# Altium project OWMR.PrjPcb
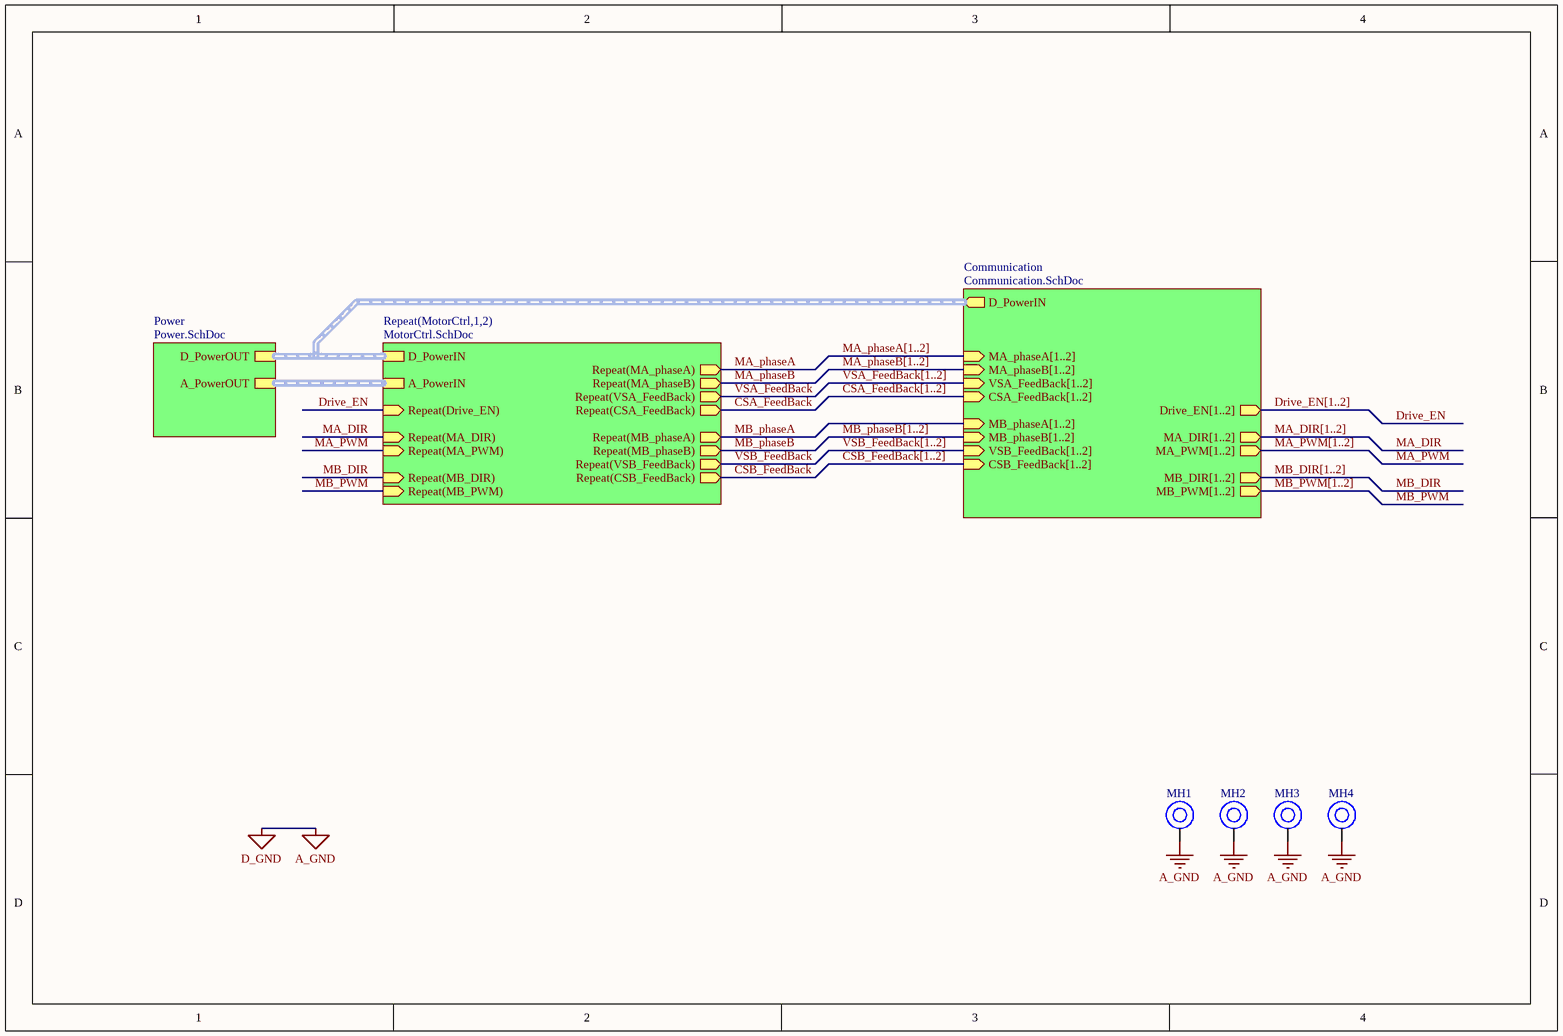
[diagram p0: Top.SchDoc]
5 sheets, 73 parts. Net scope: hierarchical (ports join the sheet entries above them; power ports are global).
Board file: Top.PcbDoc
Sheets:
  Top.SchDoc
    Power = Power.SchDoc
    MotorCtrl1 = MotorCtrl.SchDoc
    MotorCtrl2 = MotorCtrl.SchDoc
    Communication = Communication.SchDoc
  Simulation.SchDoc

## Sheet Top.SchDoc
size A4; SheetNumber: 1; SheetTotal: 4

### Parts
MH1  M3 Hole  [M3 Hole]  (value not drawn)
MH2  M3 Hole  [M3 Hole]  (value not drawn)
MH3  M3 Hole  [M3 Hole]  (value not drawn)
MH4  M3 Hole  [M3 Hole]  (value not drawn)

### Sub-sheets
Communication = Communication.SchDoc: MA_phaseA[1..2] (in), MA_phaseB[1..2] (in), VSA_FeedBack[1..2] (in), CSA_FeedBack[1..2] (in), MB_phaseA[1..2] (in), MB_phaseB[1..2] (in), VSB_FeedBack[1..2] (in), CSB_FeedBack[1..2] (in), Drive_EN[1..2] (out), MA_DIR[1..2] (out), MB_DIR[1..2] (out), MA_PWM[1..2] (out), MB_PWM[1..2] (out), D_PowerIN (out)
Power = Power.SchDoc: D_PowerOUT, A_PowerOUT
Repeat(MotorCtrl,1,2) = MotorCtrl.SchDoc: D_PowerIN, A_PowerIN, Repeat(MA_DIR) (in), Repeat(MA_PWM) (in), Repeat(MB_DIR) (in), Repeat(MB_PWM) (in), Repeat(Drive_EN) (in), Repeat(MA_phaseA) (out), Repeat(MA_phaseB) (out), Repeat(MB_phaseA) (out), Repeat(MB_phaseB) (out), Repeat(VSA_FeedBack) (out), Repeat(VSB_FeedBack) (out), Repeat(CSA_FeedBack) (out), Repeat(CSB_FeedBack) (out)

### Nets
A_GND: MH1.1 MH2.1 MH3.1 MH4.1  [also labelled D_GND]
CSA_FeedBack: sheet Repeat(MotorCtrl,1,2)/Repeat(CSA_FeedBack)
CSB_FeedBack: sheet Repeat(MotorCtrl,1,2)/Repeat(CSB_FeedBack)
Drive_EN: sheet Repeat(MotorCtrl,1,2)/Repeat(Drive_EN)
MA_DIR: sheet Repeat(MotorCtrl,1,2)/Repeat(MA_DIR)
MA_phaseA: sheet Repeat(MotorCtrl,1,2)/Repeat(MA_phaseA)
MA_phaseB: sheet Repeat(MotorCtrl,1,2)/Repeat(MA_phaseB)
MA_PWM: sheet Repeat(MotorCtrl,1,2)/Repeat(MA_PWM)
MB_DIR: sheet Repeat(MotorCtrl,1,2)/Repeat(MB_DIR)
MB_phaseA: sheet Repeat(MotorCtrl,1,2)/Repeat(MB_phaseA)
MB_phaseB: sheet Repeat(MotorCtrl,1,2)/Repeat(MB_phaseB)
MB_PWM: sheet Repeat(MotorCtrl,1,2)/Repeat(MB_PWM)
VSA_FeedBack: sheet Repeat(MotorCtrl,1,2)/Repeat(VSA_FeedBack)
VSB_FeedBack: sheet Repeat(MotorCtrl,1,2)/Repeat(VSB_FeedBack)

### Buses and harness runs
bus CSA_FeedBack[1..2] = sheet Communication/CSA_FeedBack[1..2]
bus CSB_FeedBack[1..2] = sheet Communication/CSB_FeedBack[1..2]
bus Drive_EN[1..2] = sheet Communication/Drive_EN[1..2]
bus MA_DIR[1..2] = sheet Communication/MA_DIR[1..2]
bus MA_phaseA[1..2] = sheet Communication/MA_phaseA[1..2]
bus MA_phaseB[1..2] = sheet Communication/MA_phaseB[1..2]
bus MA_PWM[1..2] = sheet Communication/MA_PWM[1..2]
bus MB_DIR[1..2] = sheet Communication/MB_DIR[1..2]
bus MB_phaseB[1..2] = sheet Communication/MB_phaseB[1..2]
bus MB_PWM[1..2] = sheet Communication/MB_PWM[1..2]
bus VSA_FeedBack[1..2] = sheet Communication/VSA_FeedBack[1..2]
bus VSB_FeedBack[1..2] = sheet Communication/VSB_FeedBack[1..2]
harness sheet Communication/D_PowerIN = sheet Power/D_PowerOUT = sheet Repeat(MotorCtrl,1,2)/D_PowerIN
harness sheet Power/A_PowerOUT = sheet Repeat(MotorCtrl,1,2)/A_PowerIN

### Library data of the parts
MH1-MH4 = M3_Hole

## Sheet Power.SchDoc
size A4; SheetNumber: 2; SheetTotal: 5; SPICEModelCacheCCCFIGUR: <root> / <DocumentId>CCCFIGUR</DocumentId> / <CacheFrame Number="0"> / <Model Name="led0" Kind="MDL"> / <Text>*Typ INFRARED GaAs LED: Vf=1.2V Vr=5V If=40mA trr=3uS / *LED Pinout: 1=A, 2=K / .MODEL LED0 D (IS=93.5P RS=84M N=2.63 BV=5 IBV=10U / + CJO=2.97P VJ=.75 M=.333 TT=4.32U)</Text> / </Model> / </CacheFrame> / </root>
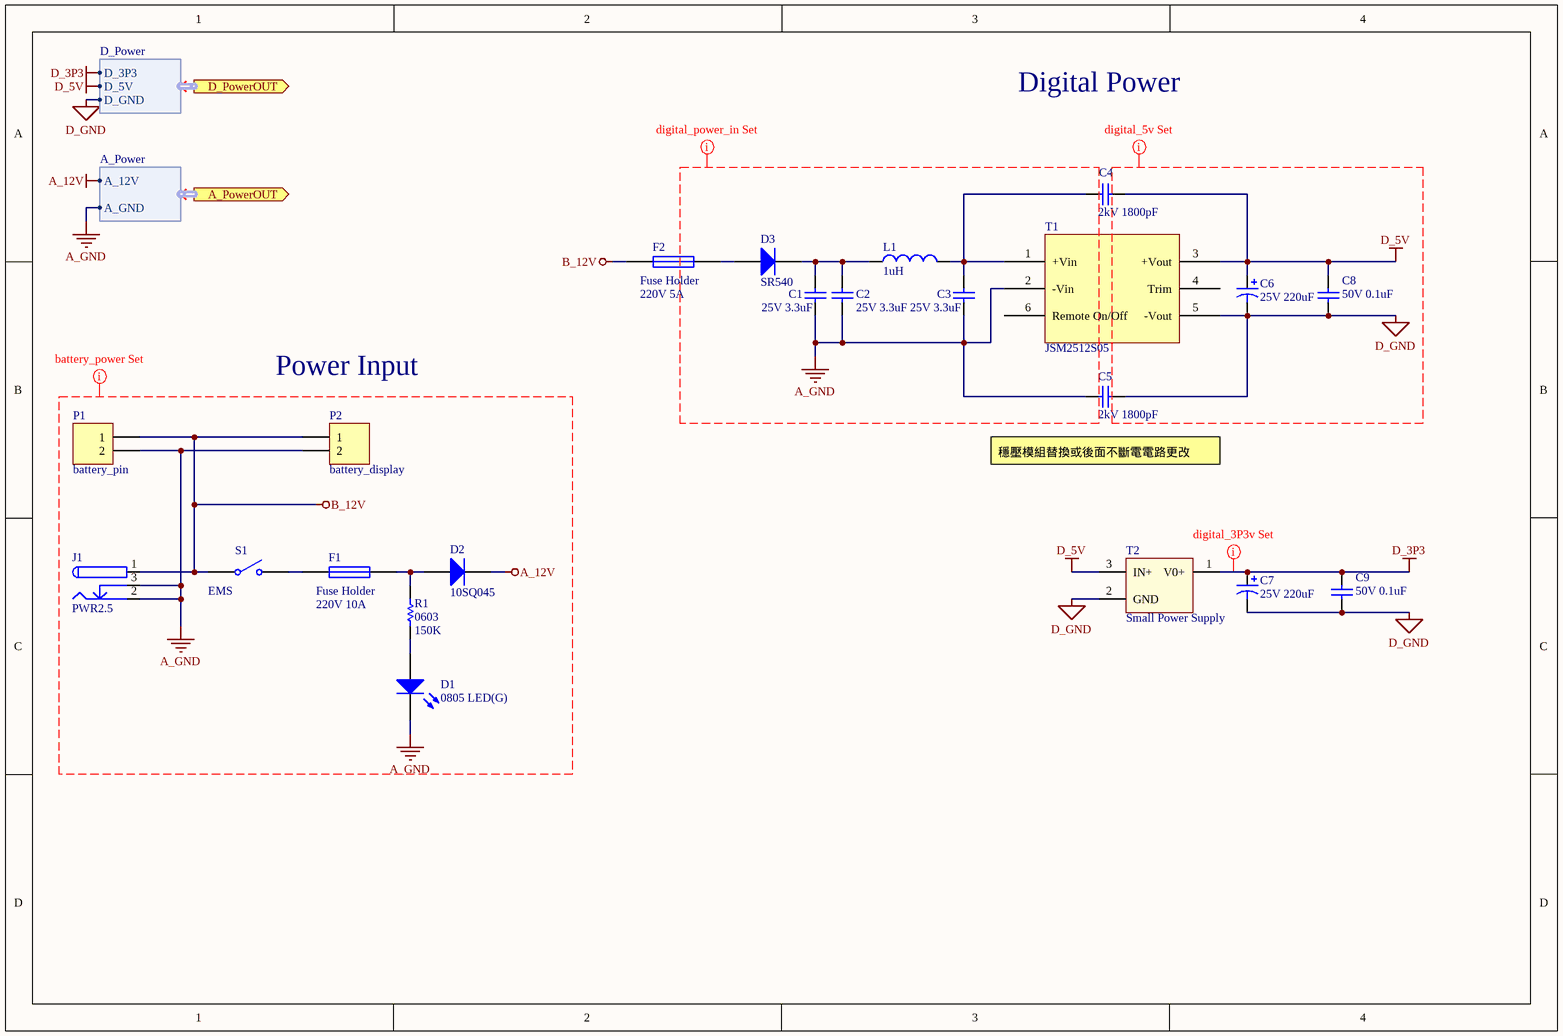
[diagram p1: Power.SchDoc]

### Parts
C1  25V 3.3uF  [1210 SMD]
C2  25V 3.3uF  [1210 SMD]
C3  25V 3.3uF  [1210 SMD]
C4  2kV 1800pF  [1206 SMD]
C5  2kV 1800pF  [1206 SMD]
C6  25V 220uF  [RB4-8]
C7  25V 220uF  [RB4-8]
C8  50V 0.1uF  [C1206]
C9  50V 0.1uF  [C1206]
D1  0805 LED(G)  [0805 SMD DIode]
D2  10SQ045  [10SQ045]
D3  SR540  [SR540]
F1  Fuse Holder  value 220V 10A  [SMD Fuses Holder]
F2  Fuse Holder  value 220V 5A  [SMD Fuses Holder]
J1  PWR2.5  [PWD2.5]
L1  1uH  [DFE2HCAH1R0MJ0L]
P1  battery_pin  [KF2EDGR-5.08 2P]
P2  battery_display  [B2B-XH-A]
R1  0603  value 150K  [0603 SMD Res]
S1  EMS  [4.8插片]
T1  JSM2512S05  [JSM2524S05]
T2  Small Power Supply  [Samll Power Supply]

### Ports
A_PowerOUT (out, harness A_Power), D_PowerOUT (out, harness D_Power)

### Harnesses
D_Power: D_3P3, D_5V, D_GND
A_Power: A_12V, A_GND

### Nets
A_12V: D2.2(K) ; port A_PowerOUT.A_12V
A_GND: C1.2 C2.2 C3.2 C5.1 C5.2 C6.2 C7.2 C8.1 C9.1 D1.2(K) J1.2 J1.3 P1.2 P2.2 T1.2(-Vin) T1.5(-Vout) T2.2(GND) ; port D_PowerOUT.D_GND, port A_PowerOUT.A_GND  [also labelled D_GND]
B_12V: F2.1 J1.1 P1.1 P2.1 S1.1(COMMON)
D_3P3: C7.1 C9.2 T2.1(V0+) ; port D_PowerOUT.D_3P3  [project net 3P3]
D_5V: C4.2 C6.1 C8.2 T1.3(+Vout) T2.3(IN+) ; port D_PowerOUT.D_5V  [project net 5V]
NetC1_1: C1.1 C2.1 D3.2(K) L1.1
NetC3_1: C3.1 C4.1 L1.2 T1.1(+Vin)
NetD1_1: D1.1(A) R1.1
NetD2_1: D2.1(A) F1.2 R1.2
NetD3_1: D3.1(A) F2.2
NetF1_1: F1.1 S1.2(NO)

Not connected (* = marked no-connect by the designer): T1 4(Trim) 6(Remote_On/Off)

### Layout directives
net class battery_power; rule Clearance Constraint [Generic clearance = 0.65mm, and 9 value(s) for objects]; rule Width Constraint [Pref Width = 1.67mm    Min Width = 0.254mm    Max Width = 2mm]; rule Routing Via Style [Pref Size = 1.67mm    Pref Hole Size = 0.9mm]: A_12V, A_GND, B_12V
net class digital_power_in; rule Clearance Constraint [Generic clearance = 0.65mm, and 9 value(s) for objects]; rule Width Constraint [Pref Width = 0.29mm    Min Width = 0.254mm    Max Width = 0.31mm]; rule Routing Via Style [Pref Size = 20mil    Pref Hole Size = 10mil]: A_GND
net class digital_5v; rule Clearance Constraint [Generic clearance = 0.61mm, and 9 value(s) for objects]; rule Width Constraint [Pref Width = 0.8mm    Min Width = 0.254mm    Max Width = 1mm]; rule Routing Via Style [Pref Size = 50mil    Pref Hole Size = 28mil]: D_5V, D_GND
net class digital_3P3v; rule Clearance Constraint [Generic clearance = 0.6mm, and 9 value(s) for objects]; rule Width Constraint [Pref Width = 0.254mm    Min Width = 0.254mm    Max Width = 0.381mm]; rule Routing Via Style [Pref Size = 20mil    Pref Hole Size = 10mil]: 3P3

### Notes on the sheet
- Digital Power
- Power Input
- (near C5) 穩壓模組替換或後面不斷電電路更改

### Library data of the parts
C1-C3 = Cap: 50V 3.3uF 1210 MLCC; Published: 8-Jun-2000; LatestRevisionDate: 17-Jul-2002; LatestRevisionNote: Re-released for DXP Platform.; PackageReference: RAD-0.3; Publisher: Altium Limited; PackageDescription: Radial Cap, Thru-Hole; 2 Leads; 0.3 in Pin Spacing; Value: 3.3uF
C4 C5 = Cap: Capacitor; Published: 8-Jun-2000; LatestRevisionDate: 17-Jul-2002; LatestRevisionNote: Re-released for DXP Platform.; PackageReference: RAD-0.3; Publisher: Altium Limited; PackageDescription: Radial Cap, Thru-Hole; 2 Leads; 0.3 in Pin Spacing; Value: 1800pF
C6 C7 = Cap Pol1: DIP cap; Value: 1000uF; Published: 8-Jun-2000; LatestRevisionDate: 17-Jul-2002; LatestRevisionNote: Re-released for DXP Platform.; PackageReference: RB7.6-15; Publisher: Altium Limited; PackageDescription: Polarized Capacitor (Radial); 2 Leads; ComponentLink1Description: buy_link; ComponentLink1URL: https://shopee.tw/(%E5%85%83%E8%80%80)-%E7%9B%B4%E6%8F%92-%E9%9B%BB%E8%A7%A3%E9%9B%BB%E5%AE%B9-47uF~1000uF-16V~50V-%E9%AB%94%E7%A9%8D-8*14.5mm~10*19.5mm(5%E9%A1%86%E4%B8%80%E6%A8%99)-i.140576581.2524079905?sp_atk=ccd45567-e386-4bfb-a6e8-2480335a57a5
C8 C9 = Cap Semi: 0805F105Z250CT; Value: 1uF; Published: 8-Jun-2000; LatestRevisionDate: 29-May-2009; LatestRevisionNote: IPC-7351 Footprint Added.; PackageReference: C1206; Publisher: Altium Limited; PackageDescription: Chip Capacitor
D1 = LED0: Typical INFRARED GaAs LED; Published: 8-Jun-2000; LatestRevisionDate: 08-Jul-2005; LatestRevisionNote: Mech Layer 1 removed.; PackageReference: LED-0; Publisher: Altium Limited; PackageDescription: LED; 2 Leads
D2 D3 = Diode: Default Diode; Published: 8-Jun-2000; LatestRevisionDate: 17-Jul-2002; LatestRevisionNote: Re-released for DXP Platform.; PackageVersion: Sep-1996; PackageReference: SMC; Publisher: Altium Limited; PackageDescription: DO-214-AB/SMC; 2 C-Bend Leads; Body 7.9 x 5.9 mm, inc. leads (LxW); Code_JEDEC: DO-214-AB
F1 = Fuse 1: 0451010.MRL; Published: 8-Jun-2000; LatestRevisionDate: 17-Jul-2002; LatestRevisionNote: Re-released for DXP Platform.; PackageReference: PIN-W2/E2.8; Publisher: Altium Limited; PackageDescription: Thru-Hole; 2 Leads
F2 = Fuse 1: 0451005.MRL; Published: 8-Jun-2000; LatestRevisionDate: 17-Jul-2002; LatestRevisionNote: Re-released for DXP Platform.; PackageReference: PIN-W2/E2.8; Publisher: Altium Limited; PackageDescription: Thru-Hole; 2 Leads
J1 = PWR2.5: Low Voltage Power Supply Connector; Published: 17-Dec-2003; DatasheetDocument: 09-May-2002; Publisher: Altium Limited; ComponentLink1Description: Manufacturer Link; ComponentLink1URL: http://domino.kycon.com/internet/Products.html
L1 = Inductor: 1uH 3A 1008 SMD lnductor; Code_IEC: 1005; Value: 2.2uH; Published: 8-Jun-2000; LatestRevisionDate: 29-May-2009; LatestRevisionNote: IPC-7351 Footprint Added.; PackageReference: 0402-A; Publisher: Altium Limited; PackageDescription: Chip Inductor; Code_JEITA: 0402
P1 = Header 2: KF2EDGR-5.08 2P; LatestRevisionDate: 17-Jul-2002; LatestRevisionNote: Re-released for DXP Platform.; Publisher: Altium Limited
P2 = Header 2: B2B-XH-A; LatestRevisionDate: 17-Jul-2002; LatestRevisionNote: Re-released for DXP Platform.; Publisher: Altium Limited
R1 = Res1: Resistor; Published: 8-Jun-2000; LatestRevisionDate: 17-Jul-2002; LatestRevisionNote: Re-released for DXP Platform.; PackageReference: AXIAL-0.3; Publisher: Altium Limited; PackageDescription: Axial Device, Thru-Hole; 2 Leads; 0.3 in Pin Spacing
S1 = SW-SPST: Published: 24-Mar-1999; LatestRevisionDate: 17-Jul-2002; LatestRevisionNote: Re-released for DXP Platform.; PackageReference: SPST-2; Publisher: Altium Limited; PackageDescription: Switch; 2 Leads
T1 = JSM2524S05: JSM2524S05 Isolation DC-DC converter
T2 = PowerSupply 3P: BuyLink: https://www.ruten.com.tw/item/show?21817939184609

## Sheet MotorCtrl.SchDoc
size A4; Organization: Altium Limited; Address1: L3, 12a Rodborough Rd; Address2: Frenchs Forest; Address3: NSW; Address4: Australia 2086; SheetNumber: 3; SheetTotal: 5; SPICEModelCacheSOUJEWZH: <root> / <DocumentId>SOUJEWZH</DocumentId> / <CacheFrame Number="0"> / <Model Name="cap" Kind="MDL"> / <Text>*Default semiconductor capacitor / .MODEL CAP C()</Text> / </Model> / </CacheFrame> / </root>
Used 2 times, as channels MotorCtrl1, MotorCtrl2. Parts and nets are listed once, with the designators drawn on the sheet.
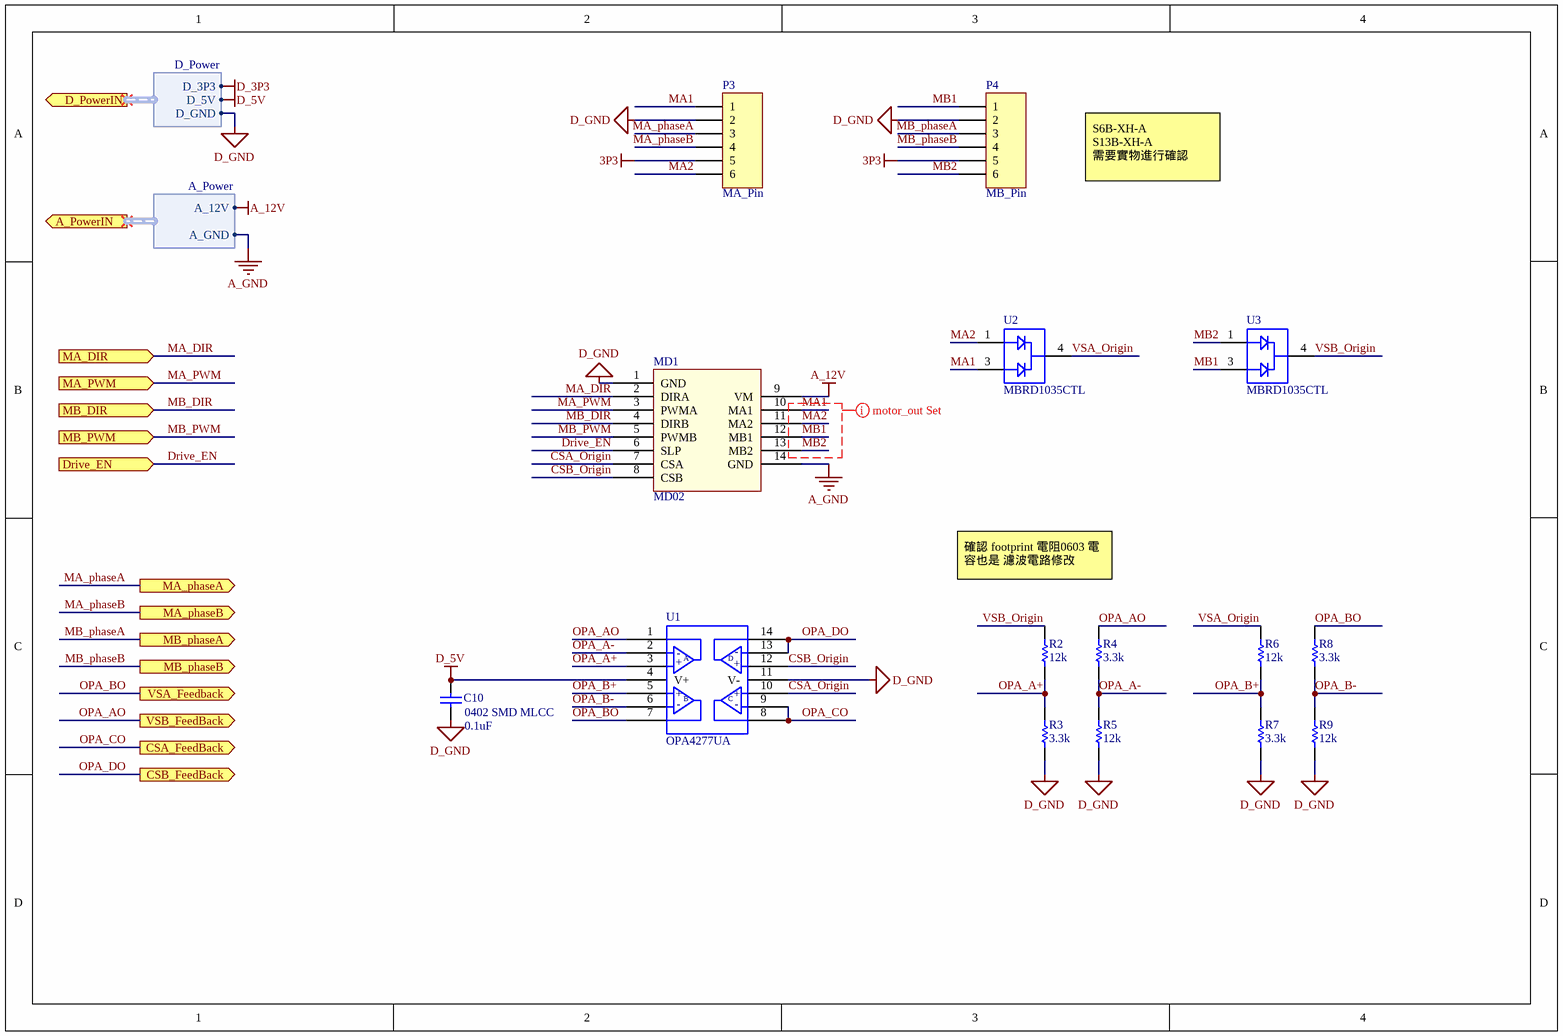
[diagram p2: MotorCtrl.SchDoc]

### Parts
C10  0402 SMD MLCC  value 0.1uF  [0402]
MD1  MD02  [MOTOR_DRIVER]
P3  MA_Pin  [S6B-XH-A]
P4  MB_Pin  [S6B-XH-A]
R2  12k  [0402 SMD Res]
R3  3.3k  [0402 SMD Res]
R4  3.3k  [0402 SMD Res]
R5  12k  [0402 SMD Res]
R6  12k  [0402 SMD Res]
R7  3.3k  [0402 SMD Res]
R8  3.3k  [0402 SMD Res]
R9  12k  [0402 SMD Res]
U1  OPA4277UA  [OPA4277UA]
U2  MBRD1035CTL  [MBRD1035CTL]
U3  MBRD1035CTL  [MBRD1035CTL]

### Ports
A_PowerIN (out, harness A_Power), CSA_FeedBack (out), CSB_FeedBack (out), D_PowerIN (out, harness D_Power), Drive_EN (in), MA_DIR (in), MA_phaseA (out), MA_phaseB (out), MA_PWM (in), MB_DIR (in), MB_phaseA (out), MB_phaseB (out), MB_PWM (in), VSA_Feedback (out), VSB_FeedBack (out)

### Harnesses
D_Power: D_3P3, D_5V, D_GND
A_Power: A_12V, A_GND

### Nets
3P3: P3.5 P4.5
A_12V: MD1.9(VM) ; port A_PowerIN.A_12V
A_GND: MD1.14(GND) ; port A_PowerIN.A_GND
D_3P3: port D_PowerIN.D_3P3
D_5V: C10.1 U1.4(V+) ; port D_PowerIN.D_5V
D_GND: C10.2 MD1.1(GND) P3.2 P4.2 R3.2 R5.1 R7.2 R9.1 U1.11(V-) ; port D_PowerIN.D_GND
CSA_Origin: MD1.7(CSA) U1.10(+in_C)
CSB_Origin: MD1.8(CSB) U1.12(+In_D)
Drive_EN: MD1.6(SLP) ; port Drive_EN
MA1: MD1.10(MA1) P3.1 U2.3
MA2: MD1.11(MA2) P3.6 U2.1
MA_DIR: MD1.2(DIRA) ; port MA_DIR
MA_phaseA: P3.3 ; port MA_phaseA
MA_phaseB: P3.4 ; port MA_phaseB
MA_PWM: MD1.3(PWMA) ; port MA_PWM
MB1: MD1.12(MB1) P4.1 U3.3
MB2: MD1.13(MB2) P4.6 U3.1
MB_DIR: MD1.4(DIRB) ; port MB_DIR
MB_phaseA: P4.3 ; port MB_phaseA
MB_phaseB: P4.4 ; port MB_phaseB
MB_PWM: MD1.5(PWMB) ; port MB_PWM
OPA_A+: R2.2 R3.1 U1.3(+In_A)
OPA_A-: R4.1 R5.2 U1.2(-In_A)
OPA_AO: R4.2 U1.1(Out_A) ; port VSB_FeedBack
OPA_B+: R6.2 R7.1 U1.5(+In_B)
OPA_B-: R8.1 R9.2 U1.6(-In_B)
OPA_BO: R8.2 U1.7(Out_B) ; port VSA_Feedback
OPA_CO: U1.8(Out_C) U1.9(-In_C) ; port CSA_FeedBack
OPA_DO: U1.13(-In_D) U1.14(Out_D) ; port CSB_FeedBack
VSA_Origin: R6.1 U2.4
VSB_Origin: R2.1 U3.4

### Channels
MotorCtrl1: designators end in _1; ports CSA_FeedBack=CSA_FeedBack1 CSB_FeedBack=CSB_FeedBack1 Drive_EN=Drive_EN MA_DIR=MA_DIR MA_phaseA=MA_phaseA MA_phaseB=MA_phaseB MA_PWM=MA_PWM MB_DIR=MB_DIR MB_phaseA=MB_phaseA_MotorCtrl1 MB_phaseB=MB_phaseB MB_PWM=MB_PWM VSA_Feedback=MA_V1 VSB_FeedBack=MB_V1
MotorCtrl2: designators end in _2; ports CSA_FeedBack=CSA_FeedBack2 CSB_FeedBack=CSB_FeedBack2 Drive_EN=Drive_EN MA_DIR=MA_DIR MA_phaseA=MA_phaseA MA_phaseB=MA_phaseB MA_PWM=MA_PWM MB_DIR=MB_DIR MB_phaseA=MB_phaseA_MotorCtrl2 MB_phaseB=MB_phaseB MB_PWM=MB_PWM VSA_Feedback=MA_V2 VSB_FeedBack=MB_V2

### Layout directives
net class motor_out; rule Clearance Constraint [Generic clearance = 0.65mm, and 9 value(s) for objects]; rule Width Constraint [Pref Width = 0.381mm    Min Width = 0.254mm    Max Width = 0.381mm]; rule Routing Via Style [Pref Size = 20mil    Pref Hole Size = 10mil]: MA1, MA2, MB1, MB2

### Notes on the sheet
- S6B-XH-A
  S13B-XH-A
  需要實物進行確認
- 確認 footprint 電阻0603 電容也是 濾波電路修改
- Title
- Size:
- Date:
- A4
- Number:
- Time:
- Revision:
- Sheet
- of
- File:
- (in symbol Small Signal Amplifier) －; A; D; +; B; C

### Library data of the parts
C10 = Cap Semi: Capacitor (Semiconductor SIM Model); Published: 8-Jun-2000; LatestRevisionDate: 29-May-2009; LatestRevisionNote: IPC-7351 Footprint Added.; PackageReference: C1206; Publisher: Altium Limited; PackageDescription: Chip Capacitor
MD1 = Motor Driver: 17A 2 Cheel Motor Driver; buy_link: https://www.ruten.com.tw/item/show?21811773783671
P3 P4 = Header 6: S6B-XH-A; LatestRevisionDate: 17-Jul-2002; LatestRevisionNote: Re-released for DXP Platform.; Publisher: Altium Limited
R2-R9 = Res1: Resistor; Published: 8-Jun-2000; LatestRevisionDate: 17-Jul-2002; LatestRevisionNote: Re-released for DXP Platform.; PackageReference: AXIAL-0.3; Publisher: Altium Limited; PackageDescription: Axial Device, Thru-Hole; 2 Leads; 0.3 in Pin Spacing
U1 = Small Signal Amplifier: buy_link: https://www.ruten.com.tw/item/show?22015419000992; datasheet: https://datasheet.ciiva.com/27050/905643-27050822.pdf?src-supplier=Jameco
U2 U3 = Diode IC: 35V 10A 2 Cheel Diode; buy_link: https://www.ruten.com.tw/item/show?21744290003226; datasheet: https://datasheet.ciiva.com/905/mbrd1035ctl-d-905952.pdf?src-supplier=Digi-Key

## Sheet Communication.SchDoc
size A4; SheetNumber: 4; SheetTotal: 5; SPICEModelCacheIYTLMHPF: <root> / <DocumentId>IYTLMHPF</DocumentId> / <CacheFrame Number="0"> / <Model Name="led0" Kind="MDL"> / <Text>*Typ INFRARED GaAs LED: Vf=1.2V Vr=5V If=40mA trr=3uS / *LED Pinout: 1=A, 2=K / .MODEL LED0 D (IS=93.5P RS=84M N=2.63 BV=5 IBV=10U / + CJO=2.97P VJ=.75 M=.333 TT=4.32U)</Text> / </Model> / </CacheFrame> / </root>
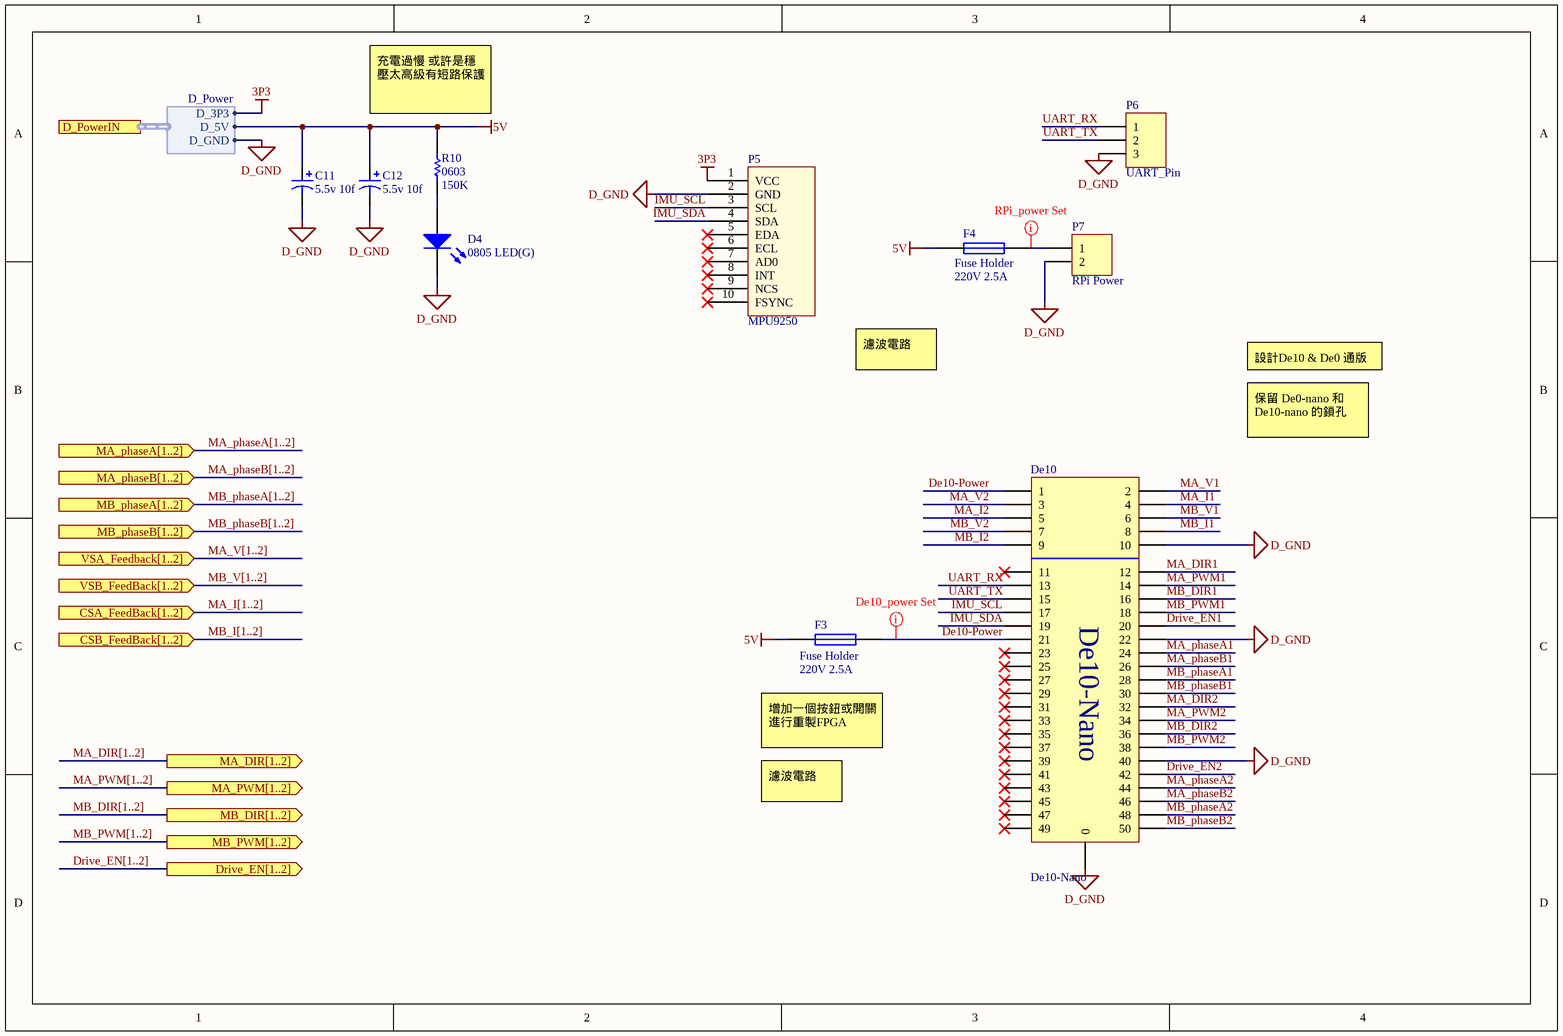
[diagram p3: Communication.SchDoc]

### Parts
C11  5.5v 10f  [SUPPYCAP-DIP_L33.0_W16.5]
C12  5.5v 10f  [SUPPYCAP-DIP_L33.0_W16.5]
D4  0805 LED(G)  [0805 SMD DIode]
De10  De10-Nano  [De10-Nano]
F3  Fuse Holder  value 220V 2.5A  [SMD Fuses Holder]
F4  Fuse Holder  value 220V 2.5A  [SMD Fuses Holder]
P5  MPU9250  [MPU9250]
P6  UART_Pin  [B3B-XH-A]
P7  RPi Power  [B2B-XH-A]
R10  0603  value 150K  [0603 SMD Res]

### Ports
CSA_FeedBack[1..2] (in), CSB_FeedBack[1..2] (in), D_PowerIN (harness D_Power), Drive_EN[1..2] (out), MA_DIR[1..2] (out), MA_phaseA[1..2] (in), MA_phaseB[1..2] (in), MA_PWM[1..2] (out), MB_DIR[1..2] (out), MB_phaseA[1..2] (in), MB_phaseB[1..2] (in), MB_PWM[1..2] (out), VSA_Feedback[1..2] (in), VSB_FeedBack[1..2] (in)

### Harnesses
D_Power: D_3P3, D_5V, D_GND

### Nets
3P3: P5.1(VCC) ; port D_PowerIN.D_3P3
5V: C11.1 C12.1 F3.1 F4.1 R10.2 ; port D_PowerIN.D_5V
D_GND: C11.2 C12.2 D4.2(K) De10.0 De10.10 De10.22 De10.40 P5.2(GND) P6.3 P7.2 ; port D_PowerIN.D_GND  [project net A_GND]
De10-Power: De10.1 De10.21 F3.2
Drive_EN1: De10.20  [project net Drive_EN]
Drive_EN2: De10.42  [project net Drive_EN]
IMU_SCL: De10.17 P5.3(SCL)
IMU_SDA: De10.19 P5.4(SDA)
MA_DIR1: De10.12  [project net MA_DIR]
MA_DIR2: De10.32  [project net MA_DIR]
MA_I1: De10.4  [project net CSA_FeedBack1]
MA_I2: De10.5  [project net CSA_FeedBack2]
MA_phaseA1: De10.24  [project net MA_phaseA]
MA_phaseA2: De10.44  [project net MA_phaseA]
MA_phaseB1: De10.26  [project net MA_phaseB]
MA_phaseB2: De10.46  [project net MA_phaseB]
MA_PWM1: De10.14  [project net MA_PWM]
MA_PWM2: De10.34  [project net MA_PWM]
MA_V1: De10.2
MA_V2: De10.3
MB_DIR1: De10.16  [project net MB_DIR]
MB_DIR2: De10.36  [project net MB_DIR]
MB_I1: De10.8  [project net CSB_FeedBack1]
MB_I2: De10.9  [project net CSB_FeedBack2]
MB_phaseA1: De10.28
MB_phaseA2: De10.48
MB_phaseB1: De10.30  [project net MB_phaseB]
MB_phaseB2: De10.50  [project net MB_phaseB]
MB_PWM1: De10.18  [project net MB_PWM]
MB_PWM2: De10.38  [project net MB_PWM]
MB_V1: De10.6
MB_V2: De10.7
UART_RX: De10.13 P6.1
UART_TX: De10.15 P6.2
NetD4_1: D4.1(A) R10.1
NetF4_2: F4.2 P7.1

Not connected (* = marked no-connect by the designer): De10 11* 23* 25* 27* 29* 31* 33* 35* 37* 39* 41* 43* 45* 47* 49*; P5 5(EDA)* 6(ECL)* 7(AD0)* 8(INT)* 9(NCS)* 10(FSYNC)*

### Buses and harness runs
bus Drive_EN[1..2] = port Drive_EN[1..2]
bus MA_DIR[1..2] = port MA_DIR[1..2]
bus MA_I[1..2] = port CSA_FeedBack[1..2]
bus MA_phaseA[1..2] = port MA_phaseA[1..2]
bus MA_phaseB[1..2] = port MA_phaseB[1..2]
bus MA_PWM[1..2] = port MA_PWM[1..2]
bus MA_V[1..2] = port VSA_Feedback[1..2]
bus MB_DIR[1..2] = port MB_DIR[1..2]
bus MB_I[1..2] = port CSB_FeedBack[1..2]
bus MB_phaseA[1..2] = port MB_phaseA[1..2]
bus MB_phaseB[1..2] = port MB_phaseB[1..2]
bus MB_PWM[1..2] = port MB_PWM[1..2]
bus MB_V[1..2] = port VSB_FeedBack[1..2]

### Layout directives
net class De10_power; rule Clearance Constraint [Generic clearance = 0.61mm, and 9 value(s) for objects]; rule Width Constraint [Pref Width = 0.41mm    Min Width = 0.41mm    Max Width = 0.45mm]; rule Routing Via Style [Pref Size = 20mil    Pref Hole Size = 10mil]: De10-Power, NetF4_2

### Notes on the sheet
- (near R10) 充電過慢 或許是穩壓太高級有短路保護
- 濾波電路
- 設計De10 & De0 通版
- 保留 De0-nano 和 De10-nano 的鎖孔
- 增加一個按鈕或開關進行重製FPGA

### Library data of the parts
C11 C12 = Cap Pol1: Super Capacitor; Published: 8-Jun-2000; LatestRevisionDate: 17-Jul-2002; LatestRevisionNote: Re-released for DXP Platform.; PackageReference: RB7.6-15; Publisher: Altium Limited; PackageDescription: Polarized Capacitor (Radial); 2 Leads
D4 = LED0: Typical INFRARED GaAs LED; Published: 8-Jun-2000; LatestRevisionDate: 08-Jul-2005; LatestRevisionNote: Mech Layer 1 removed.; PackageReference: LED-0; Publisher: Altium Limited; PackageDescription: LED; 2 Leads
F3 F4 = Fuse 1: 0451005.MRL; Published: 8-Jun-2000; LatestRevisionDate: 17-Jul-2002; LatestRevisionNote: Re-released for DXP Platform.; PackageReference: PIN-W2/E2.8; Publisher: Altium Limited; PackageDescription: Thru-Hole; 2 Leads
P5 = IMU Pin: 3 axis Gyro, Acceleration, Magmetic
P6 = Header 3: B3B-XH-A; LatestRevisionDate: 17-Jul-2002; LatestRevisionNote: Re-released for DXP Platform.; Publisher: Altium Limited
P7 = Header 2: B2B-XH-A; LatestRevisionDate: 17-Jul-2002; LatestRevisionNote: Re-released for DXP Platform.; Publisher: Altium Limited
R10 = Res1: Resistor; Published: 8-Jun-2000; LatestRevisionDate: 17-Jul-2002; LatestRevisionNote: Re-released for DXP Platform.; PackageReference: AXIAL-0.3; Publisher: Altium Limited; PackageDescription: Axial Device, Thru-Hole; 2 Leads; 0.3 in Pin Spacing

## Sheet Simulation.SchDoc
size A4; SheetNumber: 5; SheetTotal: 5
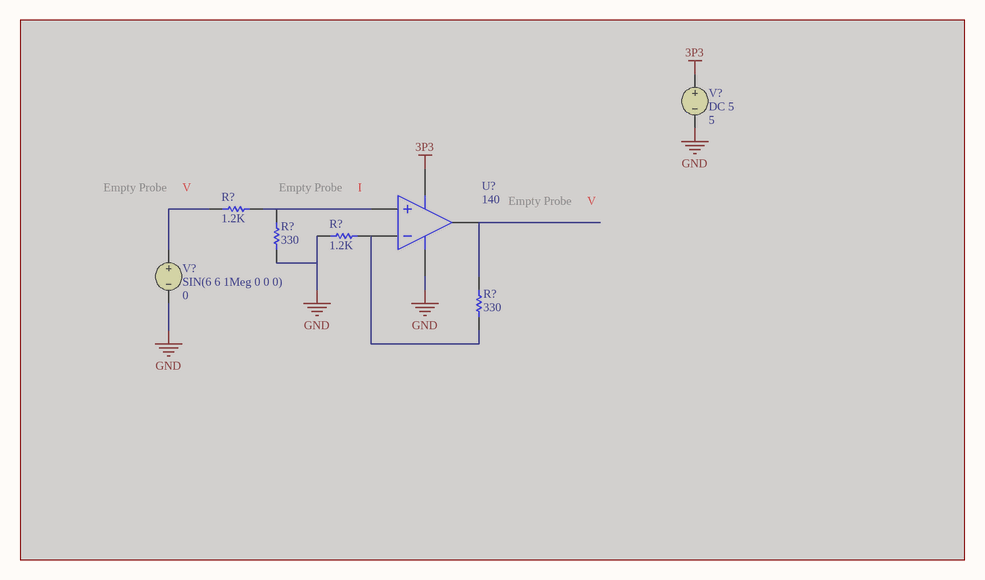
[diagram p4: Simulation.SchDoc]

### Parts
(Parts that share a designator on the sheet are numbered #1, #2 ... from top to bottom, then left to right.)
R?#1  value 1.2K  (hidden comment: Resistor)  (masked out: inside a compile mask, not in the netlist)
R?#2  value 1.2K  (hidden comment: Resistor)  (masked out: inside a compile mask, not in the netlist)
R?#3  value 330  (hidden comment: Resistor)  (masked out: inside a compile mask, not in the netlist)
R?#4  value 330  (hidden comment: Resistor)  (masked out: inside a compile mask, not in the netlist)
U?  GAIN: 140  (hidden comment: Ideal Operational Amplifier)  (masked out: inside a compile mask, not in the netlist)
V?#1  DC 5  value 5  (masked out: inside a compile mask, not in the netlist)
V?#2  SIN(6 6 1Meg 0 0 0)  DC Magnitude: 0  (masked out: inside a compile mask, not in the netlist)

### Library data of the parts
R?#1-R?#4 = Resistor: TC1: 0; SimulationGenericComponent: True; TC2: 0
U? = OpAmp with power terminals: SimulationGenericComponent: True
V?#1 = VSRC: Voltage Source; Note: PCB Footprint - Not required; AC Magnitude: 1; AC Phase: 0; Published: 30-July-2020; LatestRevisionDate: 30-July-2020; LatestRevisionNote: Re-released for DXP Platform.; PackageReference: Not Applicable; Publisher: Altium Limited
V?#2 = VSRC: Voltage Source; Note: PCB Footprint - Not required; Offset: 6; Published: 30-July-2020; LatestRevisionDate: 30-July-2020; LatestRevisionNote: Re-released for DXP Platform.; PackageReference: Not Applicable; Publisher: Altium Limited; AC Magnitude: 0; AC Phase: 0; Amplitude: 6; Frequency: 1Meg; Delay: 0; Damping Factor: 0; Phase: 0

## Nets that join several sheets
3P3: Power (C7.1 C9.2 T2.1), MotorCtrl1 (P3_1.5 P4_1.5), MotorCtrl2 (P3_2.5 P4_2.5), Communication (P5.1)
5V: Power (5 pins), MotorCtrl1 (C10_1.1 U1_1.4), MotorCtrl2 (C10_2.1 U1_2.4), Communication (5 pins)
A_12V: Power (D2.2), MotorCtrl1 (MD1_1.9), MotorCtrl2 (MD1_2.9)
A_GND: Top (MH1.1 MH2.1 MH3.1 MH4.1), Power (17 pins), MotorCtrl1 (10 pins), MotorCtrl2 (10 pins), Communication (10 pins)
CSA_FeedBack1: MotorCtrl1 (U1_1.8 U1_1.9), Communication (De10.4)
CSA_FeedBack2: MotorCtrl2 (U1_2.8 U1_2.9), Communication (De10.5)
CSB_FeedBack1: MotorCtrl1 (U1_1.13 U1_1.14), Communication (De10.8)
CSB_FeedBack2: MotorCtrl2 (U1_2.13 U1_2.14), Communication (De10.9)
Drive_EN: MotorCtrl1 (MD1_1.6), Communication (De10.20)
Drive_EN: MotorCtrl2 (MD1_2.6), Communication (De10.42)
MA_DIR: MotorCtrl1 (MD1_1.2), Communication (De10.12)
MA_DIR: MotorCtrl2 (MD1_2.2), Communication (De10.32)
MA_phaseA: MotorCtrl1 (P3_1.3), Communication (De10.24)
MA_phaseA: MotorCtrl2 (P3_2.3), Communication (De10.44)
MA_phaseB: MotorCtrl1 (P3_1.4), Communication (De10.26)
MA_phaseB: MotorCtrl2 (P3_2.4), Communication (De10.46)
MA_PWM: MotorCtrl1 (MD1_1.3), Communication (De10.14)
MA_PWM: MotorCtrl2 (MD1_2.3), Communication (De10.34)
MA_V1: MotorCtrl1 (R8_1.2 U1_1.7), Communication (De10.2)
MA_V2: MotorCtrl2 (R8_2.2 U1_2.7), Communication (De10.3)
MB_DIR: MotorCtrl1 (MD1_1.4), Communication (De10.16)
MB_DIR: MotorCtrl2 (MD1_2.4), Communication (De10.36)
MB_phaseB: MotorCtrl1 (P4_1.4), Communication (De10.30)
MB_phaseB: MotorCtrl2 (P4_2.4), Communication (De10.50)
MB_PWM: MotorCtrl1 (MD1_1.5), Communication (De10.18)
MB_PWM: MotorCtrl2 (MD1_2.5), Communication (De10.38)
MB_V1: MotorCtrl1 (R4_1.2 U1_1.1), Communication (De10.6)
MB_V2: MotorCtrl2 (R4_2.2 U1_2.1), Communication (De10.7)